# EAGLE schematic Control Overview (EAGLE 9.0.1)
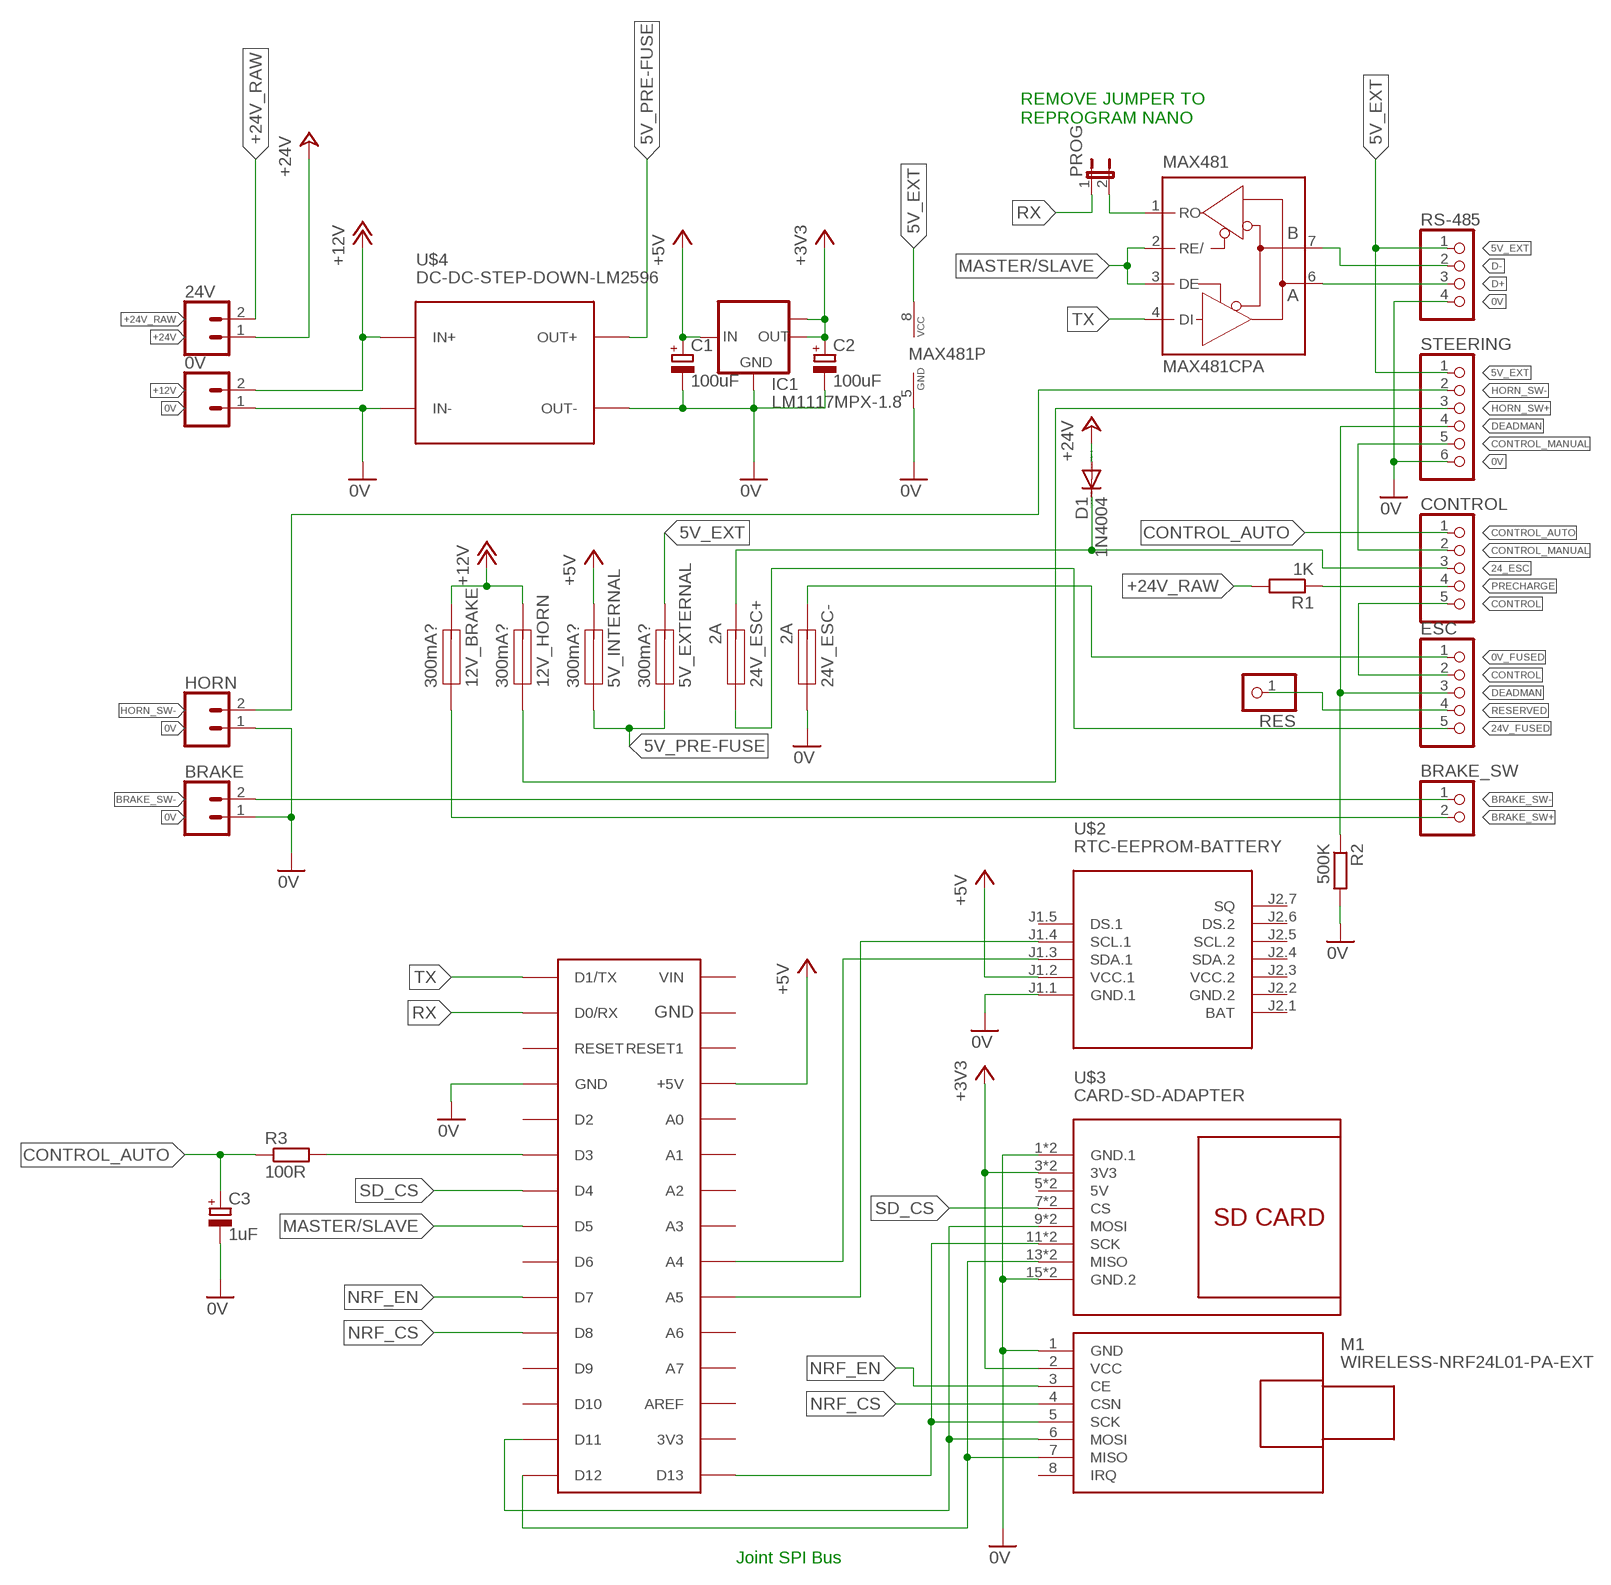
[diagram p0: schematic, sheet 1]

## Parts
0V  CONN_025MM  [SCREWTERMINAL-5MM-2]
5V_EXTERNAL  300mA?  FUSE_HOLDER  [BLADE_FUSE_HOLDER]
5V_INTERNAL  300mA?  FUSE_HOLDER  [BLADE_FUSE_HOLDER]
12V_BRAKE  300mA?  FUSE_HOLDER  [BLADE_FUSE_HOLDER]
12V_HORN  300mA?  FUSE_HOLDER  [BLADE_FUSE_HOLDER]
24V  CONN_025MM  [SCREWTERMINAL-5MM-2]
24V_ESC+  2A  FUSE_HOLDER  [BLADE_FUSE_HOLDER]
24V_ESC-  2A  FUSE_HOLDER  [BLADE_FUSE_HOLDER]
BRAKE  CONN_025MM  [SCREWTERMINAL-5MM-2]
BRAKE_SW  PINHD-1X2/90  [1X02/90]
C1  100uF  CPOL-EUE2.5-7  [E2,5-7]
C2  100uF  CPOL-EUE2.5-7  [E2,5-7]
C3  1uF  CPOL-EUE2.5-5  [E2,5-5]
CONTROL  PINHD-1X5/90  [1X05/90]
D1  1N4004  [DO41-10]
ESC  PINHD-1X5/90  [1X05/90]
HORN  CONN_025MM  [SCREWTERMINAL-5MM-2]
IC1  LM1117MPX-1.8  [SOT223]
M1  WIRELESS-NRF24L01-PA-EXT  [WIRELESS-NRF24L01-PA-EXT]
MAX481  MAX481CPA  [DIL08]
PROG  JP1E  [JP1]
R1  1K  R-EU_0204/7  [0204/7]
R2  500K  R-EU_0204/7  [0204/7]
R3  100R  R-EU_0204/7  [0204/7]
RES  PINHD-1X1  [1X01]
RS-485  PINHD-1X4/90  [1X04/90]
STEERING  PINHD-1X6/90  [1X06/90]
U$1  ARDUINONANO  [PDIP-32]
U$2  RTC-EEPROM-BATTERY  [RTC-EEPROM-BATTERY]
U$3  CARD-SD-ADAPTER  [CARD-SD-ADAPTER]
U$4  DC-DC-STEP-DOWN-LM2596  [DC-DC-STEP-DOWN-LM2596]

## Nets
0V: 0V.1 24V_ESC-.F1 BRAKE.1 C1.- C2.- C3.- HORN.1 IC1.1(GND) M1.1(GND) MAX481.5(GND) R2.2 RS-485.4 STEERING.6 U$1.GND U$1.GND1(GND) U$2.J1.1(GND.1) U$3.1(GND.1) U$3.2(GND.1) U$3.15(GND.2) U$3.16(GND.2) U$4.IN- U$4.OUT-
0V_FUSED: 24V_ESC-.F2 ESC.1
5V_EXT: 5V_EXTERNAL.F2 MAX481.8(VCC) RS-485.1 STEERING.1
5V_PRE-FUSE: 5V_EXTERNAL.F1 5V_INTERNAL.F1 U$4.OUT+
24_ESC: 24V_ESC+.F2 CONTROL.3 D1.C
24V_FUSED: 24V_ESC+.F1 ESC.5
+3V3: C2.+ IC1.2(OUT) IC1.TAB(OUT1) M1.2(VCC) U$3.3(3V3) U$3.4(3V3)
+5V: 5V_INTERNAL.F2 C1.+ IC1.3(IN) U$1.+5V U$2.J1.2(VCC.1)
+12V: 0V.2 12V_BRAKE.F2 12V_HORN.F2 U$4.IN+
+24V: 24V.1 D1.A
+24V_RAW: 24V.2 R1.2
BRAKE_SW+: 12V_BRAKE.F1 BRAKE_SW.2
BRAKE_SW-: BRAKE.2 BRAKE_SW.1
CONTROL: CONTROL.5 ESC.2
CONTROL_AUTO: C3.+ CONTROL.1 R3.1
CONTROL_MANUAL: CONTROL.2 STEERING.5
D+: MAX481.6(A) RS-485.3
D-: MAX481.7(B) RS-485.2
DEADMAN: ESC.3 R2.1 STEERING.4
HORN_SW+: 12V_HORN.F1 STEERING.3
HORN_SW-: HORN.2 STEERING.2
MASTER/SLAVE: MAX481.2(RE/) MAX481.3(DE) U$1.D5
N$1: M1.5(SCK) U$1.D13 U$3.11(SCK) U$3.12(SCK)
N$2: MAX481.1(RO) PROG.2
N$3: M1.7(MISO) U$1.D12 U$3.13(MISO) U$3.14(MISO)
N$4: R3.2 U$1.D3
N$5: M1.6(MOSI) U$1.D11 U$3.9(MOSI) U$3.10(MOSI)
N$12: U$1.A4 U$2.J1.3(SDA.1)
N$13: U$1.A5 U$2.J1.4(SCL.1)
NRF_CS: M1.4(CSN) U$1.D8
NRF_EN: M1.3(CE) U$1.D7
PRECHARGE: CONTROL.4 R1.1
RESERVED: ESC.4 RES.1
RX: PROG.1 U$1.D0/RX
SD_CS: U$1.D4 U$3.7(CS) U$3.8(CS)
TX: MAX481.4(DI) U$1.D1/TX
Unconnected: M1.8(IRQ) U$1.3V3 U$1.A0 U$1.A1 U$1.A2 U$1.A3 U$1.A6 U$1.A7 U$1.AREF U$1.D2 U$1.D6 U$1.D9 U$1.D10 U$1.RESET U$1.RESET1 U$1.VIN U$2.J1.5(DS.1) U$2.J2.1(BAT) U$2.J2.4(SDA.2) U$2.J2.5(SCL.2) U$2.J2.6(DS.2) U$2.J2.7(SQ)

## Notes on the sheet
- REMOVE JUMPER TO 
  REPROGRAM NANO
- Joint SPI Bus

## Power pins joined to a net without a drawn wire
5V: U$3.5(5V) U$3.6(5V)
GND.2: U$2.J2.2(GND.2)
VCC.2: U$2.J2.3(VCC.2)

## Library data of the parts
0V 24V BRAKE HORN = SparkFun-Connectors:CONN_02: Multi connection point. Often used as Generic Header-pin footprint for 0.1 inch spaced/style header connections On any of the 0.1 inch spaced packages, you can populate with these: Break Away Headers - Straight <https://www.sparkfun.com/products/116> (PRT-00116) Break Away Male Headers - Right Angle <https://www.sparkfun.com/products/553> (PRT-00553) Female Headers <https://www.sparkfun.com/products/115> (PRT-00115) Break Away Headers - Machine Pin <https://www.sparkfun.com/products/117> (PRT-00117) Break Away Female Headers - Swiss Machine Pin <https://www.sparkfun.com/products/743> (PRT-00743) For SCREWTERMINALS and SPRING TERMINALS visit here: Screw Terimnals on SparkFun.com <https://www.sparkfun.com/search/results?term=Screw+Terminals> (5mm/3.5mm/2.54mm spacing) This device is also useful as a general connection point to wire up your design to another part of your project. Our various solder wires solder well into these plated through hole pads. Hook-Up Wire - Assortment (Stranded, 22 AWG) <https://www.sparkfun.com/products/11375> (PRT-11375) Hook-Up Wire - Assortment (Solid Core, 22 AWG) <https://www.sparkfun.com/products/11367> (PRT-11367) View the entire wire category on our website here <https://www.sparkfun.com/categories/141> Special notes: Molex polarized connector foot print use with: PRT-08233 with associated crimp pins and housings. 2.54_SCREWTERM for use with PRT-10571. 3.5mm Screw Terminal footprints for PRT-08084 5mm Screw Terminal footprints for use with PRT-08432; SF_SKU: PRT-08432
5V_EXTERNAL 5V_INTERNAL 12V_BRAKE 12V_HORN 24V_ESC+ 24V_ESC- = Blade Fuse Holder:FUSE_HOLDER
BRAKE_SW = pinhead:PINHD-1X2: PIN HEADER
C1-C3 = rcl:CPOL-EU: POLARIZED CAPACITOR, European symbol; SPICEPREFIX: C
CONTROL ESC = pinhead:PINHD-1X5: PIN HEADER
D1 = diode:1N4004: DIODE general purpose rectifier, 1 A
IC1 = lm1117:LM1117MPX-*
M1 = diy-modules:WIRELESS-NRF24L01-PA-EXT: 2.4 GHz Wireless Module based on NRF24L01 chip with preamplifier and external antenna Click here to find device on ebay.com <http://www.ebay.com/sch/nrf24l01+pa+lna+sma>
MAX481 = maxim:MAX481CPA: RS485 TRANSEIVER; MPN: MAX481CPA+; OC_FARNELL: unknown; OC_NEWARK: 99K3445
PROG = jumper:JP1E: JUMPER
R1-R3 = rcl:R-EU_: RESISTOR, European symbol; SPICEPREFIX: R
RES = pinhead:PINHD-1X1: PIN HEADER
RS-485 = pinhead:PINHD-1X4: PIN HEADER
STEERING = pinhead:PINHD-1X6: PIN HEADER
U$1 = jet-lib:ARDUINONANO
U$2 = diy-modules:RTC-EEPROM-BATTERY: RTC Module with Battery and EEPROM based on DS1307 and AT24C32 chips More details available here: http://henrysbench.capnfatz.com/henrys-bench/arduino-sensors-and-input/arduino-tiny-rtc-d1307-tutorial/ Click here to find device on ebay.com <http://www.ebay.com/sch/tiny+rtc+arduino>
U$3 = diy-modules:CARD-SD-ADAPTER: Full Size SD Card Adapter Module with onboard 3.3V regulator Guide describing how to use SD card with Arduino is available here: https://www.arduino.cc/en/Reference/SDCardNotes Click here to find device on ebay.com <http://www.ebay.com/sch/sd+card+socket+module>
U$4 = diy-modules:DC-DC-STEP-DOWN-LM2596: DC/DC Step-Down Regulator based on LM2596-ADJ chip LM2596 datasheet available here: http://www.ti.com/lit/ds/symlink/lm2596.pdf Click here to find device on ebay.com <http://www.ebay.com/sch/lm2596+power+regulator>